# Altium project controller_BB.PrjPcb
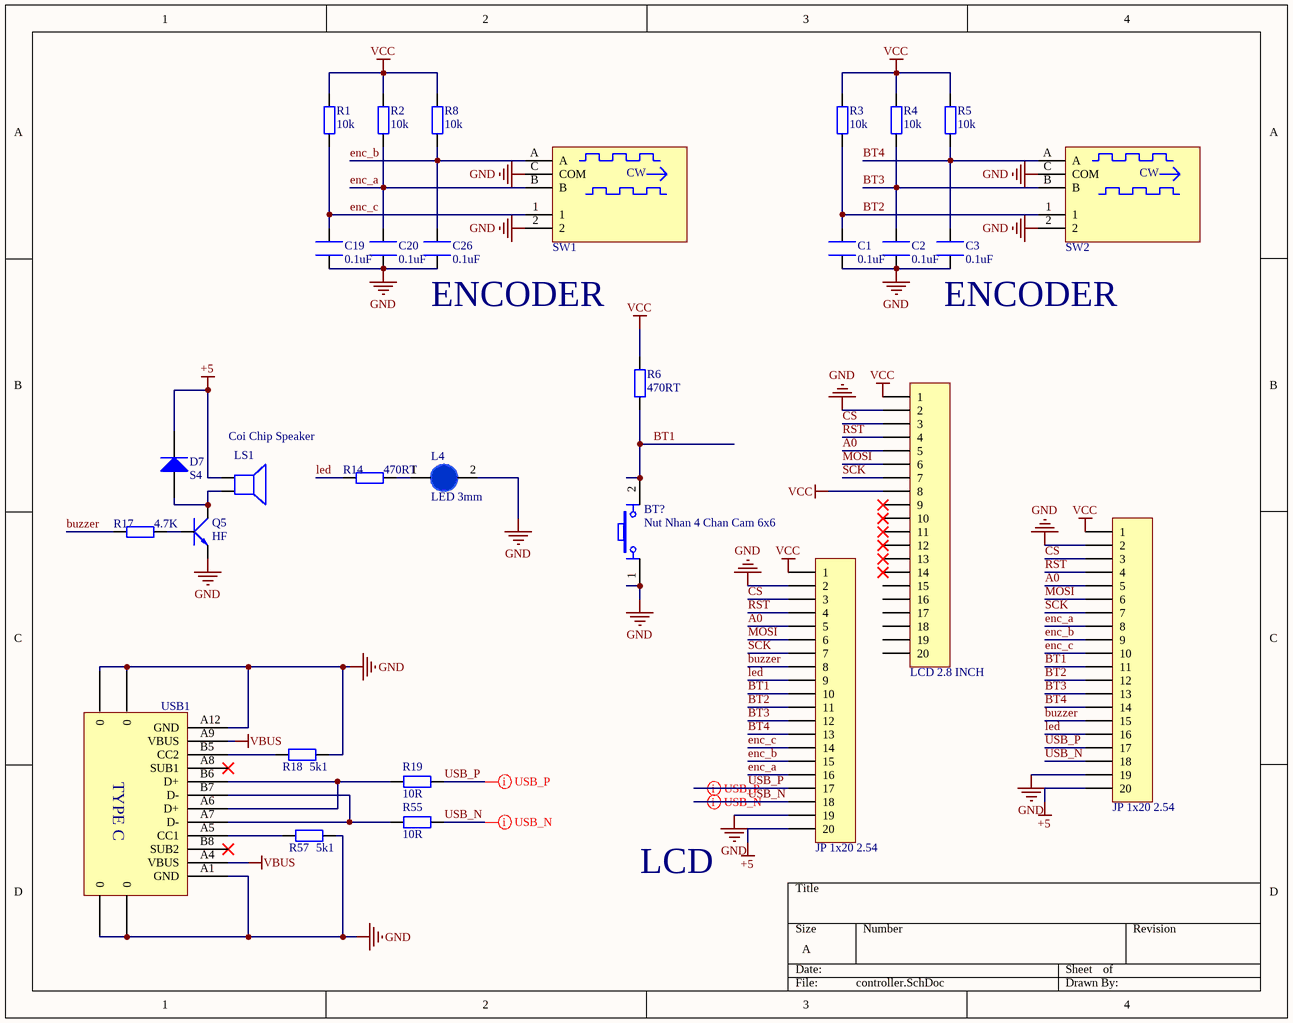
[diagram p0: controller.SchDoc]
1 sheet, 30 parts. Net scope: global (net labels, ports and power ports of the same name join across sheets).
Board files: controller.PcbDoc, controllerV2.PcbDoc

## Sheet controller.SchDoc
size A; SheetNumber: 1; SheetTotal: 1

### Parts
(Parts that share a designator on the sheet are numbered #1, #2 ... from top to bottom, then left to right.)
BT?  Nut Nhan 4 Chan Cam 6x6  [Nut Nhan 4 Chan Cam 6x6]
C1  0.1uF  [CAPC1608X09L]
C2  0.1uF  [CAPC1608X09L]
C3  0.1uF  [CAPC1608X09L]
C19  0.1uF  [CAPC1608X09L]
C20  0.1uF  [CAPC1608X09L]
C26  0.1uF  [CAPC1608X09L]
D7  S4  [DIODE SOD-123]
JP3  JP 1x20 2.54  [JP 1x20 DT]
JP?#1  LCD 2.8 INCH  [JP 1x20 DT]
JP?#2  JP 1x20 2.54  [JP 1x20 DT]
L4  LED 3mm  [LED-3MM-BLUE]
LS1  Coi Chip Speaker  [Coi Chip Speacker]
Q5  HF  [SOT-23]
R1  10k  [Tro smd 0603]
R2  10k  [Tro smd 0603]
R3  10k  [Tro smd 0603]
R4  10k  [Tro smd 0603]
R5  10k  [Tro smd 0603]
R6  470RT  [Tro smd 0603]
R8  10k  [Tro smd 0603]
R14  470RT  [Tro smd 0603]
R17  4.7K  [Tro smd 0603]
R18  5k1  [tro smd 0603]
R19  10R  [Tro smd 0603]
R55  10R  [Tro smd 0603]
R57  5k1  [tro smd 0603]
SW1  482024764004  [482024764004]  (value not drawn)
SW2  482024764004  [482024764004]  (value not drawn)
USB1  Type C 16P  [Type C 16P]  (value not drawn)

### Nets
+5: D7.2(K) JP3.20 JP?#2.20 LS1.1
GND: BT?.1 C1.1 C2.1 C3.1 C19.1 C20.1 C26.1 JP3.2 JP3.19 JP?#1.2 JP?#2.2 JP?#2.19 L4.2(K) Q5.2(E) R18.2 R57.2 SW1.2 SW1.C(COM) SW2.2 SW2.C(COM) USB1.0 USB1.A1(GND) USB1.A12(GND)
VBUS: USB1.A4(VBUS) USB1.A9(VBUS)
VCC: JP3.1 JP?#1.1 JP?#1.8 JP?#2.1 R1.2 R2.2 R3.2 R4.2 R5.2 R6.2 R8.2
A0: JP3.5 JP?#1.5 JP?#2.5
BT1: BT?.2 JP3.11 JP?#2.10 R6.1
BT2: C1.2 JP3.12 JP?#2.11 R3.1 SW2.1
BT3: C2.2 JP3.13 JP?#2.12 R4.1 SW2.B
BT4: C3.2 JP3.14 JP?#2.13 R5.1 SW2.A
buzzer: JP3.15 JP?#2.8 R17.1
CS: JP3.3 JP?#1.3 JP?#2.3
enc_a: C20.2 JP3.8 JP?#2.16 R2.1 SW1.B
enc_b: C26.2 JP3.9 JP?#2.15 R8.1 SW1.A
enc_c: C19.2 JP3.10 JP?#2.14 R1.1 SW1.1
led: JP3.16 JP?#2.9 R14.1
MOSI: JP3.6 JP?#1.6 JP?#2.6
RST: JP3.4 JP?#1.4 JP?#2.4
SCK: JP3.7 JP?#1.7 JP?#2.7
USB_N: JP3.18 JP?#2.18 R55.2
USB_P: JP3.17 JP?#2.17 R19.2
NetD7_1: D7.1(A) LS1.2 Q5.3(C)
NetL4_1: L4.1(A) R14.2
NetQ5_1: Q5.1(B) R17.2
NetR18_1: R18.1 USB1.B5(CC2)
NetR19_1: R19.1 USB1.A6(D+) USB1.B6(D+)
NetR55_1: R55.1 USB1.A7(D-) USB1.B7(D-)
NetR57_1: R57.1 USB1.A5(CC1)

Not connected (* = marked no-connect by the designer): JP?#1 9* 10* 11* 12* 13* 14* 15 16 17 18 19 20; USB1 A8(SUB1)* B8(SUB2)*

### Layout directives
differential pair: USB_N, USB_P

### Notes on the sheet
- (near C26) ENCODER
- (near C3) ENCODER
- LCD
- (in symbol 482024764004) CW
- (in symbol Type C 16P) TYPE C

### Library data of the parts
BT? = Nut Nhan 4 Chan Cam 6x6: Nut Nhan 4 Chan 6x6mm; Ten: Nút Nhấn 4 Chân 6x6x5MM DIP; Ma_Hang: MH004584
C1-C3 C19 C20 C26 = GRM188R71H104KA93D: CAP CER 0.1UF 50V X7R 0603; Manufacturer: Murata Electronics North America; Tolerance: ±10%; Supplier 1: Digi-Key; Supplier Part Number 1: 490-1519-2-ND; Manufacturer Part Number: GRM188R71H104KA93D; RoHS: RoHS Compliant; Category: Capacitors; Pricing 1: 4000=0.01822, 8000=0.01663, 12000=0.01584 (USD); Packaging: Tape & Reel (TR); Capacitance: 0.1uF; Voltage - Rated: 50V; Temperature Coefficient: X7R; Mounting Type: Surface Mount, MLCC; Operating Temperature: -55°C ~ 125°C; Applications: General Purpose; Ratings: -; Package / Case: 0603 (1608 Metric); Size / Dimension: 0.063" L x 0.032" W (1.60mm x 0.80mm); Height - Seated (Max): -; Thickness (Max): 0.035" (0.90mm); Lead Spacing: -; Features: -; Lead Style: -; ComponentLink1URL: http://www.murata.com/~/media/webrenewal/support/library/catalog/products/capacitor/mlcc/c02e.ashx?la=en-us; ComponentLink1Description: http://www.murata.com/~/media/webrenewal/support/library/catalog/products/capacitor/mlcc/c02e.ashx?la=en-us; Stock: 19812000; Part Status: Active; Supplier 2: Digi-Key; Supplier Part Number 2: 490-1519-1-ND; Pricing 2: 1=0.12, 10=0.084, 100=0.0396, 500=0.02778, 1000=0.023 (USD)
D7 = Diode S4: Dán; Ten_Linh_Kien: Diode S4 SOD123 ( 1N5819 SOD123); Ma_Hang: MH005519; Don_Vi: Con; Ghi_Chu: *; Chung_Loai: Dán; Kieu_Chan: *
JP3 JP?#1 JP?#2 = JP 1x20 2.54 Duc Thang: Cắm; Ten_Linh_Kien: Jump Đơn Đực 2.54MM 1x40P Thẳng 11MM; Don_Vi: Con; Ma_Hang: MH000903; Ghi_Chu: *; Kieu_Chan: *; Chung_Loai: Cắm
L4 = LED 3mm Xanh Duong: Cắm; Don_Vi: Con; Ma_Hang: MH009003; Ten_Linh_Kien: LED 3MM Xanh Dương SS (1000c); Ghi_Chu: *; Kieu_Chan: *; Chung_Loai: Cắm
LS1 = Coi Chip Speaker: Còi chip
Q5 = Trans C1815 HF SMD: SOT-23; Value: C9014
R1-R6 R8 R14 R17 R19 R55 = Tro 0603 5% 10R: Dán; So_Chan: 2; Ten_Linh_Kien: Trở 0603 5% 10R; Ma_Hang: MH006317; Don_Vi: Con; Chung_Loai: Dán; Kieu_Chan: *
R18 R57 = Tro 0603 5% 51k: Dán; Don_Vi: Con; So_Chan: 2; Ten_Linh_Kien: Trở 0603 5% 51k; Ma_Hang: MH007666; Chung_Loai: Dán; Kieu_Chan: *
SW1 SW2 = 482024764004: WS-ENTV Mechanical Incremental Encoder Switch, Plastic Shaft without bushing, 24Pulse/360°, 24positi; Manufacturer: Wurth Elektronik; Operation Force: 300g; Detent: 24positions; Electrical Life Encoder: 30000Cycles; Electrical Life Switch: 20000Cycles; Insulation Resistance: 100MΩ; Rated Current: 10mA; ComponentLink1Description: Website Link; ComponentLink1URL: https://www.we-online.com/redexpert/article/482024764004?ad; ComponentLink2Description: Datasheet Link; ComponentLink2URL: https://www.we-online.com/redexpert/spec/482024764004?ad; Manufacturer Part Number: 482024764004; Category: Encoder Switches; Match Code: WS-ENTV; Mount: Through Hole; Operating Temperature Max: 85°C; Operating Temperature Min: -40°C; Packaging: Tray; Length: 13.2mm; Width: 12.4mm; Height: 20mm; Resolution: 24Pulse/360°